# EAGLE design ioboard v1 (EAGLE 6.3)

## Sheet 1 of 2
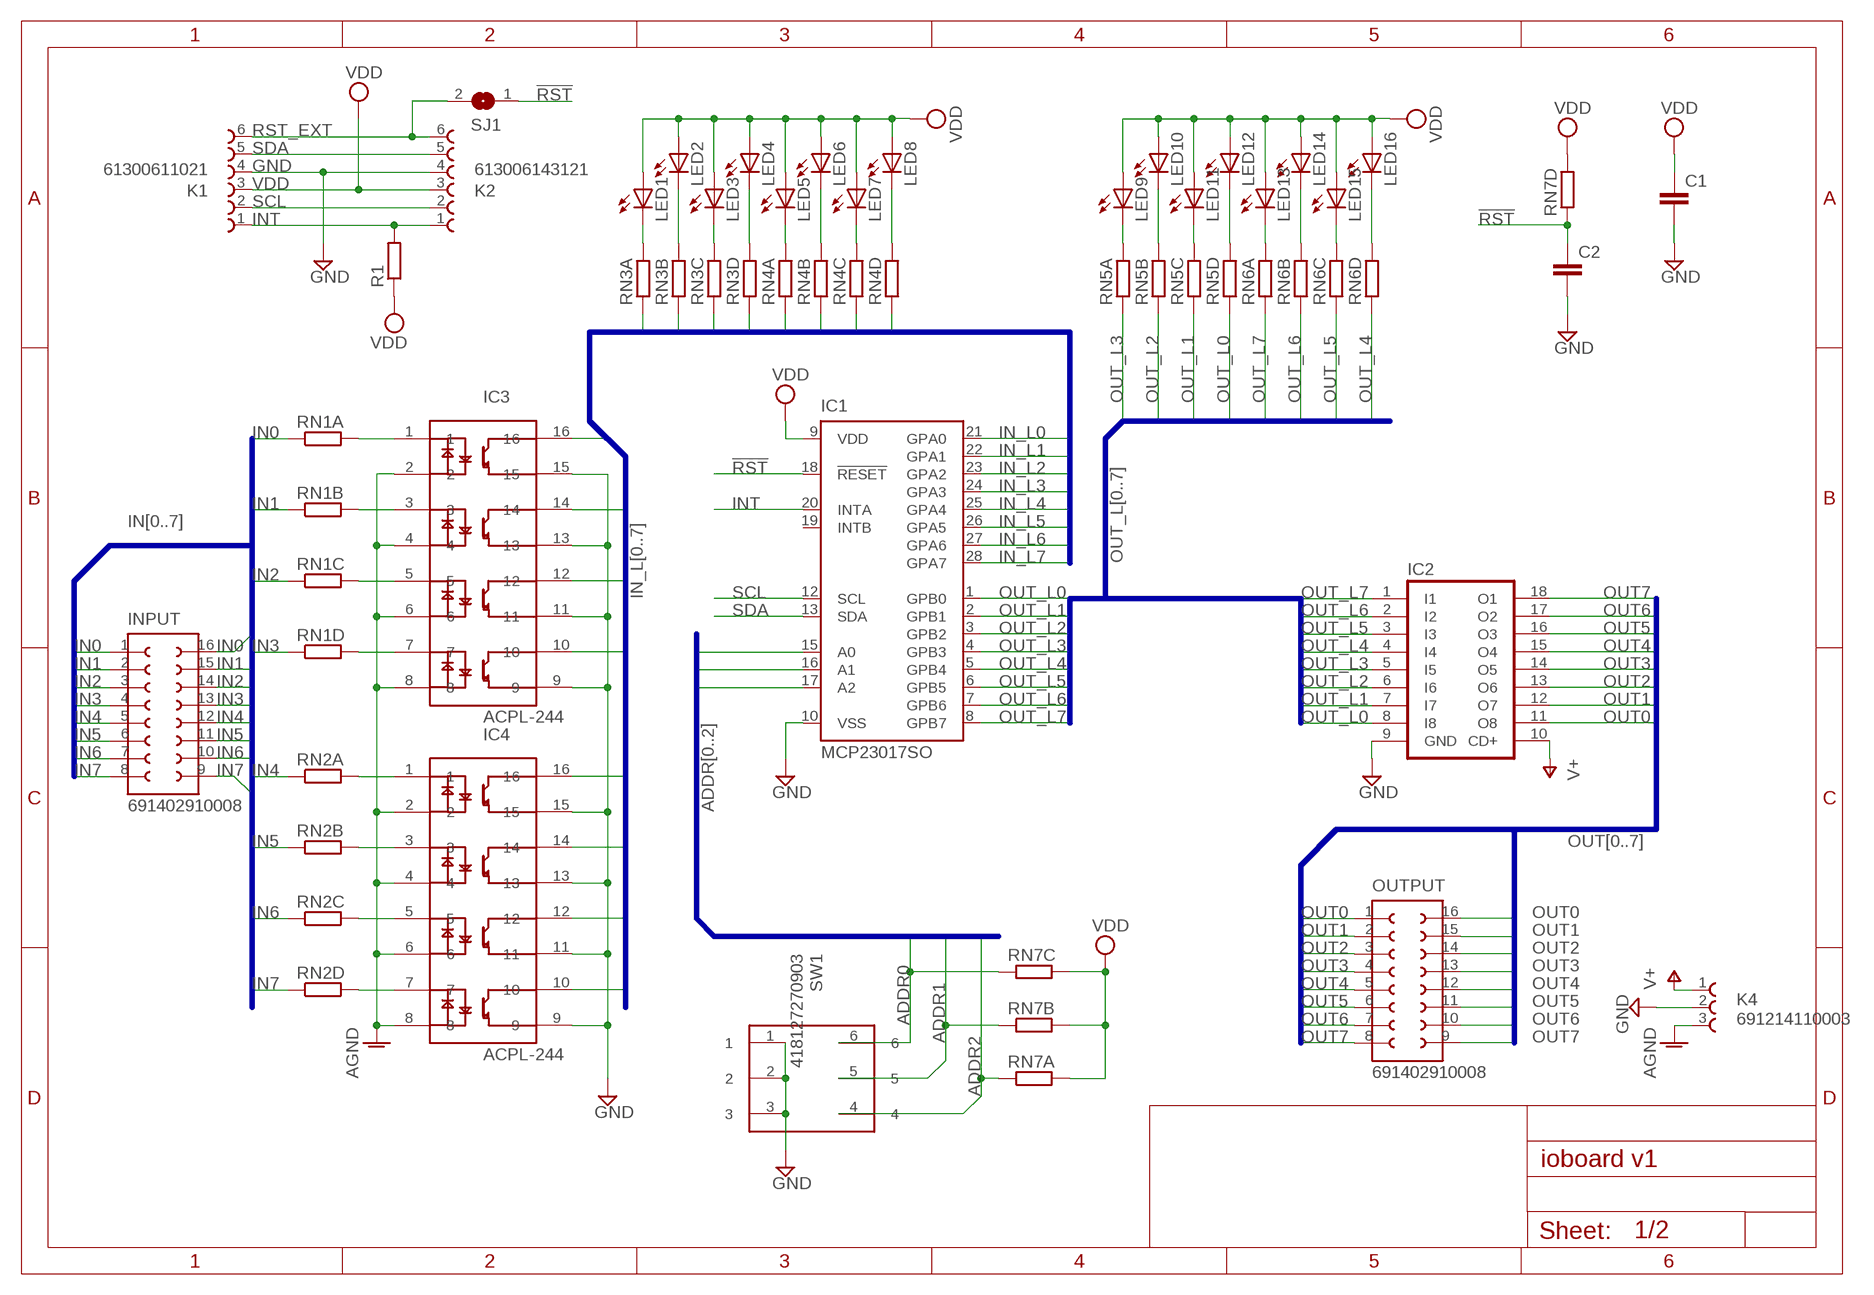
[diagram p0: schematic, sheet 1]

### Parts
C1  C-EUC0805  [C0805]
C2  C-EUC0805  [C0805]
IC1  MCP23017SO  [SO28W]
IC2  ULN2803A  [DIL18]
IC3  ACPL-244  [SO16]
IC4  ACPL-244  [SO16]
INPUT  691402910008  [691402910008]
K1  61300611021  [61300611021]
K2  613006143121  [613006143121]
K4  691214110003  [691214110003]
LED1  LEDCHIPLED_1206  [CHIPLED_1206]
LED2  LEDCHIPLED_1206  [CHIPLED_1206]
LED3  LEDCHIPLED_1206  [CHIPLED_1206]
LED4  LEDCHIPLED_1206  [CHIPLED_1206]
LED5  LEDCHIPLED_1206  [CHIPLED_1206]
LED6  LEDCHIPLED_1206  [CHIPLED_1206]
LED7  LEDCHIPLED_1206  [CHIPLED_1206]
LED8  LEDCHIPLED_1206  [CHIPLED_1206]
LED9  LEDCHIPLED_1206  [CHIPLED_1206]
LED10  LEDCHIPLED_1206  [CHIPLED_1206]
LED11  LEDCHIPLED_1206  [CHIPLED_1206]
LED12  LEDCHIPLED_1206  [CHIPLED_1206]
LED13  LEDCHIPLED_1206  [CHIPLED_1206]
LED14  LEDCHIPLED_1206  [CHIPLED_1206]
LED15  LEDCHIPLED_1206  [CHIPLED_1206]
LED16  LEDCHIPLED_1206  [CHIPLED_1206]
OUTPUT  691402910008  [691402910008]
R1  R-EU_R0805  [R0805]
RN1  RESISTOR_ARRAY_4  [RN8P-4R-CRA06S]
RN2  RESISTOR_ARRAY_4  [RN8P-4R-CRA06S]
RN3  RESISTOR_ARRAY_4  [RN8P-4R-CRA06S]
RN4  RESISTOR_ARRAY_4  [RN8P-4R-CRA06S]
RN5  RESISTOR_ARRAY_4  [RN8P-4R-CRA06S]
RN6  RESISTOR_ARRAY_4  [RN8P-4R-CRA06S]
RN7  RESISTOR_ARRAY_4  [RN8P-4R-CRA06S]
SJ1  SJ  [SJ]
SW1  418127270903  [418127270903]

### Nets
!RST: C2.1 IC1.18(!RESET) RN7.4 SJ1.1
ADDR0: IC1.15(A0) RN7.3 SW1.6
ADDR1: IC1.16(A1) RN7.2 SW1.5
ADDR2: IC1.17(A2) RN7.1 SW1.4
AGND: IC3.2 IC3.4 IC3.6 IC3.8 IC4.2 IC4.4 IC4.6 IC4.8 K4.3
GND [power]: C1.2 C2.2 IC1.10(VSS) IC2.9(GND) IC3.9 IC3.11 IC3.13 IC3.15 IC4.9 IC4.11 IC4.13 IC4.15 K1.4 K2.4 K4.2 SW1.1 SW1.2 SW1.3
IN0: INPUT.1 INPUT.16 RN1.1
IN1: INPUT.2 INPUT.15 RN1.2
IN2: INPUT.3 INPUT.14 RN1.3
IN3: INPUT.4 INPUT.13 RN1.4
IN4: INPUT.5 INPUT.12 RN2.1
IN5: INPUT.6 INPUT.11 RN2.2
IN6: INPUT.7 INPUT.10 RN2.3
IN7: INPUT.8 INPUT.9 RN2.4
IN_L0: IC1.21(GPA0) IC3.16 RN3.1
IN_L1: IC1.22(GPA1) IC3.14 RN3.2
IN_L2: IC1.23(GPA2) IC3.12 RN3.3
IN_L3: IC1.24(GPA3) IC3.10 RN3.4
IN_L4: IC1.25(GPA4) IC4.16 RN4.1
IN_L5: IC1.26(GPA5) IC4.14 RN4.2
IN_L6: IC1.27(GPA6) IC4.12 RN4.3
IN_L7: IC1.28(GPA7) IC4.10 RN4.4
INT: IC1.20(INTA) K1.1 K2.1 R1.2
N$9: IC3.1 RN1.8
N$10: IC3.3 RN1.7
N$11: IC3.5 RN1.6
N$12: IC3.7 RN1.5
N$13: IC4.1 RN2.8
N$14: IC4.3 RN2.7
N$15: IC4.5 RN2.6
N$16: IC4.7 RN2.5
N$17: LED1.C RN3.8
N$18: LED2.C RN3.7
N$25: LED9.C RN5.8
N$26: LED10.C RN5.7
N$27: LED11.C RN5.6
N$28: LED12.C RN5.5
N$29: LED3.C RN3.6
N$30: LED4.C RN3.5
N$31: LED13.C RN6.8
N$32: LED14.C RN6.7
N$33: LED15.C RN6.6
N$34: LED16.C RN6.5
N$36: LED5.C RN4.8
N$37: LED6.C RN4.7
N$38: LED7.C RN4.6
N$39: LED8.C RN4.5
OUT0 [low_impedance]: IC2.11(O8) OUTPUT.1 OUTPUT.16
OUT1 [low_impedance]: IC2.12(O7) OUTPUT.2 OUTPUT.15
OUT2 [low_impedance]: IC2.13(O6) OUTPUT.3 OUTPUT.14
OUT3 [low_impedance]: IC2.14(O5) OUTPUT.4 OUTPUT.13
OUT4 [low_impedance]: IC2.15(O4) OUTPUT.5 OUTPUT.12
OUT5 [low_impedance]: IC2.16(O3) OUTPUT.6 OUTPUT.11
OUT6 [low_impedance]: IC2.17(O2) OUTPUT.7 OUTPUT.10
OUT7 [low_impedance]: IC2.18(O1) OUTPUT.8 OUTPUT.9
OUT_L0: IC1.1(GPB0) IC2.8(I8) RN5.4
OUT_L1: IC1.2(GPB1) IC2.7(I7) RN5.3
OUT_L2: IC1.3(GPB2) IC2.6(I6) RN5.2
OUT_L3: IC1.4(GPB3) IC2.5(I5) RN5.1
OUT_L4: IC1.5(GPB4) IC2.4(I4) RN6.4
OUT_L5: IC1.6(GPB5) IC2.3(I3) RN6.3
OUT_L6: IC1.7(GPB6) IC2.2(I2) RN6.2
OUT_L7: IC1.8(GPB7) IC2.1(I1) RN6.1
RST_EXT: K1.6 K2.6 SJ1.2
SCL: IC1.12(SCL) K1.2 K2.2
SDA: IC1.13(SDA) K1.5 K2.5
V+ [low_impedance]: IC2.10(CD+) K4.1
VDD [power]: C1.1 IC1.9(VDD) K1.3 K2.3 LED1.A LED2.A LED3.A LED4.A LED5.A LED6.A LED7.A LED8.A LED9.A LED10.A LED11.A LED12.A LED13.A LED14.A LED15.A LED16.A R1.1 RN7.5 RN7.6 RN7.7 RN7.8
Unconnected: IC1.19(INTB)

### Buses
OUT[0..7]
IN_L[0..7]
IN[0..7]
OUT_L[0..7]
ADDR[0..2]

## Sheet 2 of 2

## Library data of the parts
C1 C2 = rcl:C-EU: CAPACITOR, European symbol; MF: AVX; MPN: 08051A100JAT2A; OC_FARNELL: 499158
IC1 = adafruit:MCP23017: http://ww1.microchip.com/downloads/en/DeviceDoc/21952a.pdf Source: http://ww1.microchip.com/downloads/en/DeviceDoc/21952a.pdf; MF: MICROCHIP; MPN: MCP23017-E/SO; OC_FARNELL: 1332087
IC2 = ic:ULN2803A: DRIVER ARRAY; MF: TOSHIBA; MPN: ULN2803APG; OC_FARNELL: 1047761
IC3 IC4 = ic:ACPL-244: 4-channel optocoupler by Avago; MF: AVAGO TECHNOLOGIES; MPN: ACPL-244-500E; OC_FARNELL: 1634755
INPUT OUTPUT = Wuerth_Elektronik_eiCan_14_Terminal_Blocks_WR-TBL_2_0:691402910008: WR-TBL Serie 4029 - 2.54mm Screwless Horizontal Entry - 0.5mm2 Wires, 8 Pins; OC_FARNELL: unknown
K1 = Wuerth_Elektronik_eiCan_01_Pin__Socked_Headers_v1_3:61300611021: WR-PHD 2.54mm Angled Pin Header, 6 Pins; OC_FARNELL: unknown
K2 = Wuerth_Elektronik_eiCan_01_Pin__Socked_Headers_v1_3:613006143121: WR-PHD 2.54mm Angled Socket Header, 6 Pins; OC_FARNELL: unknown
K4 = Wuerth_Elektronik_eiCan_14_Terminal_Blocks_WR-TBL_2_0:691214110003: WR-TBL Serie 2141 - 3.5mm Horizontal Entry Modular with Rising Cage Clamp - 1.3 mm2 Wires, 3 Pins; MF: WURTH ELEKTRONIK; MPN: 691214110003; OC_FARNELL: 1841251
LED1-LED16 = led:LED: LED OSRAM: - CHIPLED LG R971, LG N971, LY N971, LG Q971, LY Q971, LO R971, LY R971 LH N974, LH R974 LS Q976, LO Q976, LY Q976 LO Q996 - Hyper CHIPLED LW Q18S LB Q993, LB Q99A, LB R99A - SideLED LS A670, LO A670, LY A670, LG A670, LP A670 LB A673, LV A673, LT A673, LW A673 LH A674 LY A675 LS A676, LA A676, LO A676, LY A676, LW A676 LS A679, LY A679, LG A679 - Hyper Micro SIDELED® LS Y876, LA Y876, LO Y876, LY Y876 LT Y87S - SmartLED LW L88C, LW L88S LB L89C, LB L89S, LG L890 LS L89K, LO L89K, LY L89K LS L896, LA L896, LO L896, LY L896 - TOPLED LS T670, LO T670, LY T670, LG T670, LP T670 LSG T670, LSP T670, LSY T670, LOP T670, LYG T670 LG T671, LOG T671, LSG T671 LB T673, LV T673, LT T673, LW T673 LH T674 LS T676, LA T676, LO T676, LY T676, LB T676, LH T676, LSB T676, LW T676 LB T67C, LV T67C, LT T67C, LS T67K, LO T67K, LY T67K, LW E67C LS E67B, LA E67B, LO E67B, LY E67B, LB E67C, LV E67C, LT E67C LW T67C LS T679, LY T679, LG T679 LS T770, LO T770, LY T770, LG T770, LP T770 LB T773, LV T773, LT T773, LW T773 LH T774 LS E675, LA E675, LY E675, LS T675 LS T776, LA T776, LO T776, LY T776, LB T776 LHGB T686 LT T68C, LB T68C - Hyper Mini TOPLED® LB M676 - Mini TOPLED Santana® LG M470 LS M47K, LO M47K, LY M47K Source: http://www.osram.convergy.de LUXEON: - LUMILED® LXK2-PW12-R00, LXK2-PW12-S00, LXK2-PW14-U00, LXK2-PW14-V00 LXK2-PM12-R00, LXK2-PM12-S00, LXK2-PM14-U00 LXK2-PE12-Q00, LXK2-PE12-R00, LXK2-PE12-S00, LXK2-PE14-T00, LXK2-PE14-U00 LXK2-PB12-K00, LXK2-PB12-L00, LXK2-PB12-M00, LXK2-PB14-N00, LXK2-PB14-P00, LXK2-PB14-Q00 LXK2-PR12-L00, LXK2-PR12-M00, LXK2-PR14-Q00, LXK2-PR14-R00 LXK2-PD12-Q00, LXK2-PD12-R00, LXK2-PD12-S00 LXK2-PH12-R00, LXK2-PH12-S00 LXK2-PL12-P00, LXK2-PL12-Q00, LXK2-PL12-R00 Source: www.luxeon.com KINGBRIGHT: KA-3528ASYC Source: www.kingbright.com; OC_FARNELL: unknown
R1 = rcl:R-EU_: RESISTOR, European symbol; OC_FARNELL: unknown
RN1-RN7 = dp_devices:RESISTOR_ARRAY_4: 4 Resistor Array 0603; OC_FARNELL: unknown
SJ1 = jumper:SJ: SMD solder JUMPER; OC_FARNELL: unknown
SW1 = Eagle_Wuerth_Elektronik_Switch_Power_Elements:418127270903: WS-IC 2.54 mm small compact THT Dip Switch with raised actuator, 3 Pole; OC_FARNELL: unknown

## Net classes
0 default: width 0.4 mm, drill 0.35 mm, clearance 0.2 mm
1 power: width 1 mm, drill 0.35 mm, clearance 0.2 mm
2 low_impedance: width 1.5 mm, drill 0.35 mm, clearance 0.2 mm

## Board
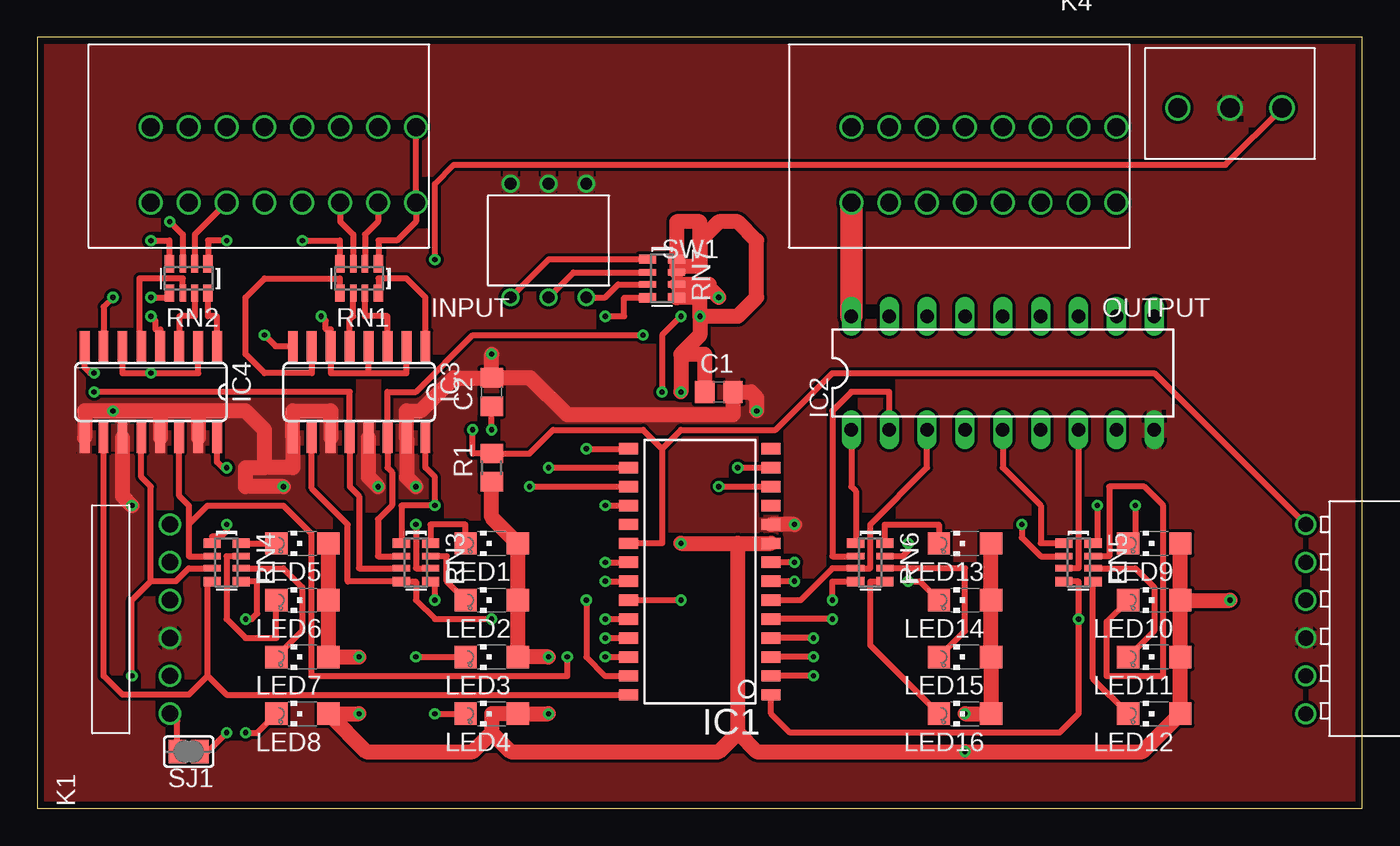
[diagram p1: board, top side]
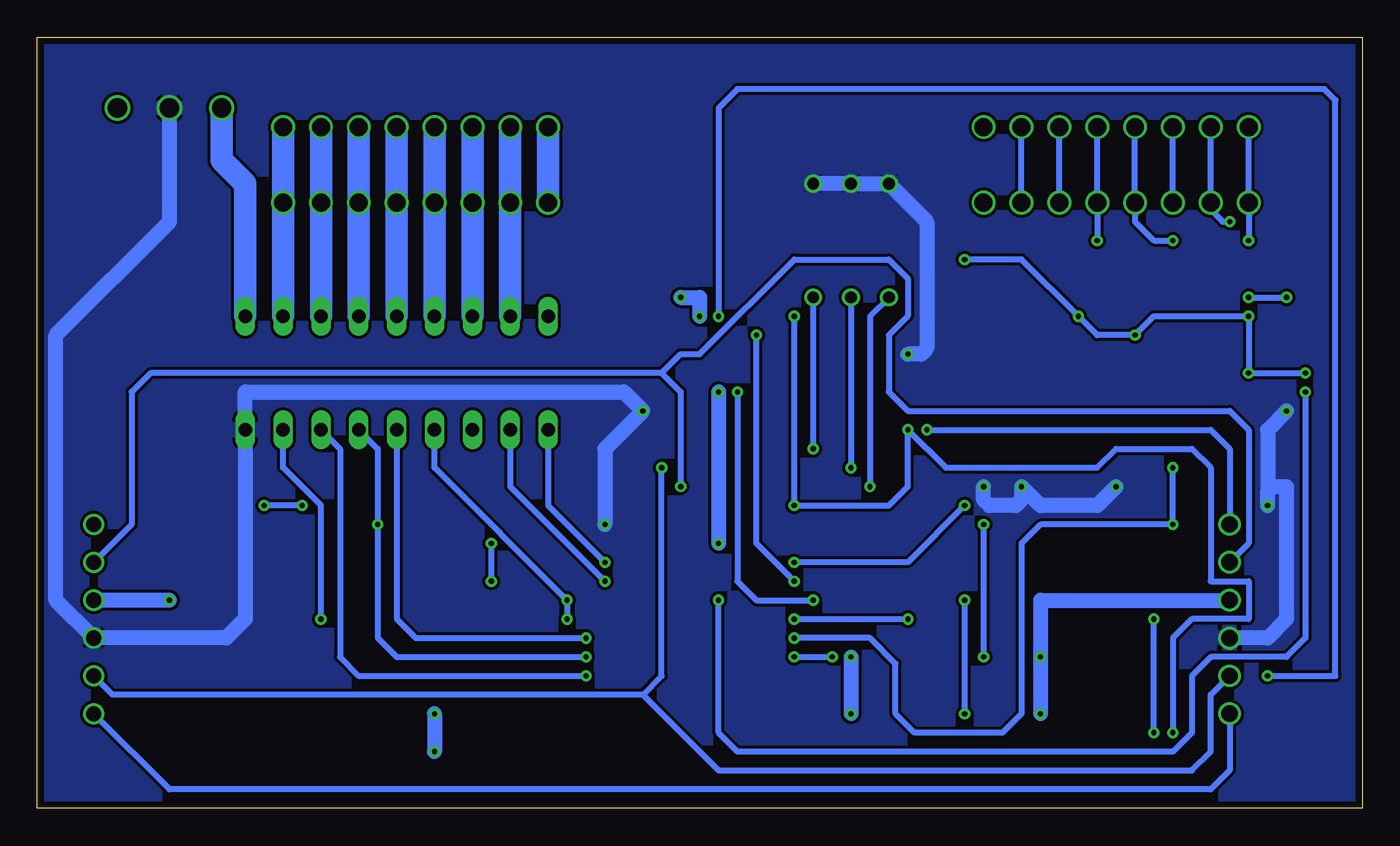
[diagram p2: board, bottom side, seen from below]

Size 88.88 x 51.74 mm. Coordinates in mm from the lower left corner, seen from the top.
Outline: 0,0 88.88,0 88.88,51.74 0,51.74 0,0
Copper layers (1*16): Top 0.018mm / dielectric 1.55mm / Bottom 0.018mm
Design rules "eC-STANDARD_pool-2-layer ": minimum track width 0.2mm, minimum drill 0.25mm, track to track 0.2mm, track to pad 0.2mm, pad to pad 0.2mm, via to via 0.2mm, smd to smd 0.15mm, copper to edge 0.45mm, drill to drill 0.3mm, minimum pad ring 0.2mm, minimum via ring 0.2mm, stop-mask expansion 0.1mm, vias tented up to drill 0mil, thermal gap 0.2mm

### Footprints (pad centres in the part's own frame; a part is rotated, then mirrored left to right if it is on the bottom)
C0805 = smd 1.3 x 1.5: 1 -0.95,0; 2 0.95,0
SO28W = smd 0.762 x 1.27: 1 -7.62,-4.78; 2 -6.35,-4.78; 3 -5.08,-4.78; 4 -3.81,-4.78; 5 -2.54,-4.78; 6 -1.27,-4.78; 7 0,-4.78; 8 1.27,-4.78; 9 2.54,-4.78; 10 3.81,-4.78; 11 5.08,-4.78; 12 6.35,-4.78; 13 7.62,-4.78; 14 8.89,-4.78; 15 8.89,4.78; 16 7.62,4.78; 17 6.35,4.78; 18 5.08,4.78; 19 3.81,4.78; 20 2.54,4.78; 21 1.27,4.78; 22 0,4.78; 23 -1.27,4.78; 24 -2.54,4.78; 25 -3.81,4.78; 26 -5.08,4.78; 27 -6.35,4.78; 28 -7.62,4.78
DIL18 = drill 0.9 long: 1 -10.16,-3.81; 2 -7.62,-3.81; 3 -5.08,-3.81; 4 -2.54,-3.81; 5 0,-3.81; 6 2.54,-3.81; 7 5.08,-3.81; 8 7.62,-3.81; 9 10.16,-3.81; 10 10.16,3.81; 11 7.62,3.81; 12 5.08,3.81; 13 2.54,3.81; 14 0,3.81; 15 -2.54,3.81; 16 -5.08,3.81; 17 -7.62,3.81; 18 -10.16,3.81
SO16 = smd 0.66 x 2.032: 1 -4.445,-3.073; 2 -3.175,-3.073; 3 -1.905,-3.073; 4 -0.635,-3.073; 5 0.635,-3.073; 6 1.905,-3.073; 7 3.175,-3.073; 8 4.445,-3.073; 9 4.445,3.073; 10 3.175,3.073; 11 1.905,3.073; 12 0.635,3.073; 13 -0.635,3.073; 14 -1.905,3.073; 15 -3.175,3.073; 16 -4.445,3.073
691402910008 = drill 1.2: 1 -10.16,0; 2 -7.62,0; 3 -5.08,0; 4 -2.54,0; 5 0,0; 6 2.54,0; 7 5.08,0; 8 7.62,0; 9 7.62,5.08; 10 5.08,5.08; 11 2.54,5.08; 12 0,5.08; 13 -2.54,5.08; 14 -5.08,5.08; 15 -7.62,5.08; 16 -10.16,5.08
61300611021 = drill 1.1: 1 6.35,0; 2 3.81,0; 3 1.27,0; 4 -1.27,0; 5 -3.81,0; 6 -6.35,0
613006143121 = drill 1.02: 1 0,0; 2 2.54,0; 3 5.08,0; 4 7.62,0; 5 10.16,0; 6 12.7,0
691214110003 = drill 1.3: 1 -3.5,0; 2 0,0; 3 3.5,0
CHIPLED_1206 = smd 1.5 x 1.5: A 0,-1.75; C 0,1.75
R0805 = smd 1.3 x 1.5: 1 -0.95,0; 2 0.95,0
RN8P-4R-CRA06S = smd 0.63 x 1.15: 1 -1.295,-0.975; 4 1.295,-0.975; 5 1.295,0.975; 8 -1.295,0.975 | smd 0.44 x 1.15: 2 -0.4,-0.975; 3 0.4,-0.975; 6 0.4,0.975; 7 -0.4,0.975
SJ = smd 1.168 x 1.6: 1 -0.762,0; 2 0.762,0
418127270903 = drill 0.8: 1 0,-3.81; 2 2.54,-3.81; 3 5.08,-3.81; 4 5.08,3.81; 5 2.54,3.81; 6 0,3.81

### Placement (x,y rotation side)
C1  45.72,27.94 0 top
C2  30.48,27.94 90 top
IC1  44.45,15.24 90 top
IC2  64.77,29.21 0 top
IC3  21.59,27.94 180 top
IC4  7.62,27.94 180 top
INPUT  15.24,45.72 180 top
K1  8.89,12.7 90 top
K2  85.09,19.05 270 top
K4  80.01,46.99 0 top
LED1  30.48,17.78 90 top
LED2  30.48,13.97 90 top
LED3  30.48,10.16 90 top
LED4  30.48,6.35 90 top
LED5  17.78,17.78 90 top
LED6  17.78,13.97 90 top
LED7  17.78,10.16 90 top
LED8  17.78,6.35 90 top
LED9  74.93,17.78 90 top
LED10  74.93,13.97 90 top
LED11  74.93,10.16 90 top
LED12  74.93,6.35 90 top
LED13  62.23,17.78 90 top
LED14  62.23,13.97 90 top
LED15  62.23,10.16 90 top
LED16  62.23,6.35 90 top
OUTPUT  62.23,45.72 180 top
R1  30.48,22.86 90 top
RN1  21.59,35.56 180 top
RN2  10.16,35.56 180 top
RN3  25.4,16.51 270 top
RN4  12.7,16.51 270 top
RN5  69.85,16.51 270 top
RN6  55.88,16.51 270 top
RN7  41.91,35.56 270 top
SJ1  10.16,3.81 180 top
SW1  36.83,38.1 180 top

### Tracks (layer width: path | path; a pad name or v marks a point on that pad's centre or on a via)
!RST  (via drill 0.35 pad 0.75)
  Top 0.4: v38.1,33.02 39.37,33.02 39.37,34.27 RN7.4 | v30.48,25.4 C2.1 | v38.1,20.32 IC1.18
  Top 0.406: SJ1.1 11.43,3.81 v12.7,5.08
  Bottom 0.4: v12.7,5.08 12.7,11.43 11.43,12.7 7.62,12.7 7.62,15.24 10.16,15.24 10.16,22.86 11.43,24.13 16.51,24.13 17.78,22.86 27.94,22.86 v30.48,25.4 30.48,21.59 31.75,20.32 v38.1,20.32 v38.1,33.02
ADDR0  (via drill 0.35 pad 0.75)
  Top 0.4: SW1.6 38.1,34.29 38.97,35.16 RN7.3 | v36.83,24.13 IC1.15
  Bottom 0.4: SW1.6 v36.83,24.13
ADDR1  (via drill 0.35 pad 0.75)
  Top 0.4: SW1.5 35.96,35.96 RN7.2 | v34.29,22.86 IC1.16
  Bottom 0.4: SW1.5 v34.29,22.86
ADDR2  (via drill 0.35 pad 0.75)
  Top 0.4: SW1.4 34.31,36.85 RN7.1 | v33.02,21.59 IC1.17
  Bottom 0.4: SW1.4 33.02,33.02 v33.02,21.59
AGND  (via drill 0.35 pad 0.75)
  Top 0.4: IC3.2 24.77,29.21 22.23,29.21 | 22.23,29.21 19.68,29.21 IC3.6 19.68,32.14 19.34,32.14 19.34,32.73 v19.05,33.02 | IC4.2 10.79,29.21 v7.62,29.21 5.71,29.21 IC4.6 | 22.23,29.21 IC3.4 | v3.81,29.21 3.55,29.21 3.17,29.59 IC4.8 | v26.67,36.83 26.67,41.91 27.94,43.18 79.7,43.18 K4.3 | v7.62,33.02 7.92,32.73 7.92,32.14 8.26,32.14 IC4.4 | v15.24,31.75 15.98,31.01 IC3.8
  Bottom 0.4: v3.81,29.21 v7.62,29.21 v7.62,33.02 13.97,33.02 v15.24,31.75 17.78,31.75 v19.05,33.02 22.86,36.83 v26.67,36.83
GND  (via drill 0.35 pad 0.75)
  Top 1: 15.24,22.86 15.24,25.4 13.97,26.67 10.79,26.67 | 10.79,26.67 8.26,26.67 | 10.79,26.67 IC4.15 | C2.2 27.94,28.89 25.72,26.67 24.77,26.67 IC3.15 24.77,22.23 v25.4,21.59 | C2.2 33.06,28.89 35.56,26.39 46.67,26.39 C1.2 47.88,27.94 48.26,27.57 v48.26,26.67 | 15.24,22.86 17.14,22.86 IC3.9 17.14,26.67 19.68,26.67 IC3.11 | v16.51,21.59 13.97,21.59 13.97,22.86 15.24,22.86 | 8.26,26.67 v5.08,26.67 3.17,26.67 IC4.9 | 8.26,26.67 IC4.13 | C2.2 v30.48,30.48 | v50.8,19.05 IC1.10 | v22.86,21.59 22.23,22.23 IC3.13 | v6.35,20.32 5.71,20.95 IC4.11
  Bottom 1: 6.35,21.21 5.97,21.59 5.08,21.59 5.08,12.7 6.35,11.43 K1.4 | v5.08,26.67 6.35,25.4 6.35,21.21 | K4.2 80.01,39.37 87.63,31.75 87.63,13.97 K2.4 76.2,11.43 74.93,12.7 IC2.9 74.93,27.94 49.53,27.94 v48.26,26.67 50.8,24.13 v50.8,19.05 | v6.35,20.32 6.35,21.21 | v16.51,21.59 17.78,20.32 21.59,20.32 v22.86,21.59 22.86,20.7 23.23,20.32 25.02,20.32 25.4,20.7 v25.4,21.59 | SW1.1 SW1.2 SW1.3 29.21,39.37 29.21,30.86 29.59,30.48 v30.48,30.48
  pour Top (isolate 0.2): 0,0 0,52.07 88.9,52.07 88.9,0
  pour Bottom (isolate 0.2): 0,0 0,52.07 88.9,52.07 88.9,0
IN0
  Top 0.4: RN1.1 22.89,38.1 24.13,38.1 25.4,39.37 INPUT.16 INPUT.1
IN1
  Top 0.4: INPUT.15 22.86,39.37 21.99,38.5 RN1.2
  Bottom 0.4: INPUT.15 INPUT.2
IN2
  Top 0.4: INPUT.14 20.32,39.37 21.19,38.5 RN1.3
  Bottom 0.4: INPUT.14 INPUT.3
IN3  (via drill 0.35 pad 0.75)
  Top 0.4: v17.78,38.1 20.3,38.1 RN1.4
  Bottom 0.4: INPUT.4 INPUT.13 v17.78,38.1
IN4  (via drill 0.35 pad 0.75)
  Top 0.4: v12.7,38.1 11.46,38.1 RN2.1
  Bottom 0.4: v12.7,38.1 13.97,38.1 15.24,39.37 INPUT.12 INPUT.5
IN5
  Top 0.4: INPUT.11 10.56,38.5 RN2.2
  Bottom 0.4: INPUT.11 INPUT.6
IN6  (via drill 0.35 pad 0.75)
  Top 0.4: v8.89,39.37 9.76,38.5 RN2.3
  Bottom 0.4: v8.89,39.37 9.36,39.37 10.16,40.17 INPUT.10 INPUT.7
IN7  (via drill 0.35 pad 0.75)
  Top 0.4: v7.62,38.1 8.87,38.1 RN2.4
  Bottom 0.4: INPUT.8 INPUT.9 v7.62,38.1
IN_L0  (via drill 0.35 pad 0.75)
  Top 0.4: RN3.1 24.43,20.32 v26.67,20.32 26.67,22.23 26.04,22.86 IC3.16 | v38.1,16.51 IC1.21
  Bottom 0.4: v26.67,20.32 30.48,16.51 v38.1,16.51
IN_L1  (via drill 0.35 pad 0.75)
  Top 0.4: RN3.2 22.86,16.91 22.86,19.39 23.79,20.32 23.79,22.56 23.5,22.86 IC3.14 23.5,27.94 25.4,27.94 29.21,31.75 v40.64,31.75 | v38.1,15.24 IC1.22
  Bottom 0.4: v38.1,15.24 40.64,17.78 v40.64,31.75
IN_L2  (via drill 0.35 pad 0.75)
  Top 0.4: RN3.3 21.59,16.11 21.59,20.95 20.95,21.59 IC3.12 20.95,27.94 v3.81,27.94 | v43.18,13.97 IC1.23
  Bottom 0.4: v3.81,27.94 3.81,11.43 5.08,10.16 10.16,10.16 11.43,8.89 11.43,5.08 12.7,3.81 41.91,3.81 43.18,5.08 v43.18,13.97
IN_L3  (via drill 0.35 pad 0.75)
  Top 0.4: IC3.10 18.41,21.47 20.84,19.05 20.84,15.21 RN3.4 25.4,15.21 25.4,13.97 26.67,12.7 v30.48,12.7 | v38.1,12.7 IC1.24
  Bottom 0.4: v38.1,12.7 v30.48,12.7
IN_L4  (via drill 0.35 pad 0.75)
  Top 0.4: v12.7,22.86 12.44,22.86 12.06,23.23 IC4.16 | v38.1,11.43 IC1.25 | v12.7,19.05 12.7,18.61 12.32,18.24 11.72,18.24 RN4.1
  Bottom 0.4: v12.7,22.86 v12.7,19.05 21.59,19.05 22.86,17.78 22.86,6.35 24.13,5.08 30.03,5.08 31.3,6.35 31.3,9.71 33.02,11.43 v38.1,11.43
IN_L5  (via drill 0.35 pad 0.75)
  Top 0.4: 10.16,19.05 10.16,20.32 9.53,20.95 IC4.14 | 10.16,19.05 10.16,16.91 RN4.2 | 10.16,19.05 11.43,20.32 16.51,20.32 18.38,18.45 18.38,8.89 35.56,8.89 v35.56,10.16 | v38.1,10.16 IC1.26
  Bottom 0.4: v38.1,10.16 v35.56,10.16
IN_L6  (via drill 0.35 pad 0.75)
  Top 0.4: 7.62,15.24 7.62,21.59 6.99,22.23 IC4.12 | v6.35,8.89 6.35,13.97 7.62,15.24 | 7.62,15.24 9.29,15.24 10.16,16.11 RN4.3 | v36.83,13.97 36.83,10.16 38.1,8.89 IC1.27 | v43.18,33.02 41.91,31.75 v41.91,27.94
  Bottom 0.4: v41.91,27.94 41.91,15.24 40.64,13.97 v36.83,13.97 | v6.35,8.89 1.8,8.89 1.8,47.52 2.54,48.26 41.91,48.26 43.18,46.99 v43.18,33.02
IN_L7
  Top 0.4: 11.43,8.89 10.16,7.62 5.71,7.62 4.45,8.89 IC4.10 | 11.43,8.89 11.43,15.21 RN4.4 | 11.43,8.89 12.7,7.62 IC1.28
INT  (via drill 0.35 pad 0.75)
  Top 0.4: 41.91,24.13 40.64,25.4 34.61,25.4 33.02,23.81 R1.2 29.21,23.81 v29.21,25.4 | 41.91,24.13 41.91,17.78 IC1.20 | 41.91,24.13 43.18,25.4 49.53,25.4 53.34,29.21 74.93,29.21 K2.1
  Bottom 0.4: v29.21,25.4 10.16,25.4 8.89,24.13 K1.1
N$9
  Top 0.4: IC3.1 26.04,34.29 24.77,35.56 22.89,35.56 RN1.8
N$10
  Top 0.4: IC3.3 23.5,33.02 21.99,33.02 RN1.7
N$11
  Top 0.4: IC3.5 20.95,32.78 21.19,33.02 RN1.6
N$12
  Top 0.4: IC3.7 18.41,29.21 15.24,29.21 13.97,30.48 13.97,34.29 15.24,35.56 20.3,35.56 RN1.5
N$13
  Top 0.4: IC4.1 12.06,33.02 11.46,33.02 RN2.8
N$14
  Top 0.4: RN2.7 10.56,33.02 9.53,33.02 IC4.3
N$15
  Top 0.4: RN2.6 9.76,35.56 6.84,35.56 6.84,31.01 IC4.5
N$16  (via drill 0.35 pad 0.75)
  Top 0.4: v5.08,34.29 4.45,33.66 IC4.7 | v7.62,34.29 8.87,34.29 RN2.5
  Bottom 0.4: v7.62,34.29 v5.08,34.29
N$17
  Top 0.4: LED1.C 28.73,19.05 26.38,19.05 RN3.8
N$18
  Top 0.4: LED2.C 27.46,15.23 27.46,16.91 RN3.7
N$25  (via drill 0.35 pad 0.75)
  Top 0.4: v73.66,20.32 73.66,18.26 LED9.C | v71.12,20.32 71.12,17.8 RN5.8
  Bottom 0.4: v71.12,20.32 v73.66,20.32
N$26
  Top 0.4: LED10.C 71.73,12.52 71.73,8.89 75.53,8.89 75.53,20.32 74.26,21.59 71.92,21.59 71.92,16.91 RN5.7
N$27
  Top 0.4: RN5.6 73.66,16.11 74.93,14.84 74.93,11.91 LED11.C
N$28
  Top 0.4: LED12.C 70.83,8.71 RN5.5
N$29  (via drill 0.35 pad 0.75)
  Top 0.4: v25.4,10.16 LED3.C | v25.4,19.05 25.4,16.11 RN3.6
  Bottom 0.4: v25.4,19.05 v25.4,10.16
N$30  (via drill 0.35 pad 0.75)
  Top 0.4: v26.67,6.35 LED4.C | v26.67,13.97 26.67,15.21 RN3.5
  Bottom 0.4: v26.67,13.97 v26.67,6.35
N$31
  Top 0.4: RN6.8 56.85,19.05 60.48,19.05 LED13.C
N$32  (via drill 0.35 pad 0.75)
  Top 0.4: v58.42,17.78 58.42,17.29 58.05,16.91 RN6.7 | v58.42,15.24 59.21,15.24 LED14.C
  Bottom 0.4: v58.42,15.24 v58.42,17.78
N$33
  Top 0.4: LED15.C 62.23,11.91 62.23,16.11 RN6.6
N$34
  Top 0.4: LED16.C 55.88,10.95 55.88,15.21 RN6.5
N$36
  Top 0.4: RN4.8 13.97,17.8 13.99,17.78 LED5.C
N$37
  Top 0.4: RN4.7 12.7,16.91 12.7,12.7 13.97,11.43 16.03,11.43 LED6.C
N$38
  Top 0.4: RN4.6 16.51,16.11 17.78,14.84 17.78,11.91 LED7.C
N$39  (via drill 0.35 pad 0.75)
  Top 0.4: v13.97,12.7 14.39,12.7 14.77,13.07 14.77,15.21 RN4.5 | v13.97,5.08 14.76,5.08 LED8.C
  Bottom 0.4: v13.97,5.08 v13.97,12.7
OUT0
  Bottom 1.5: IC2.11 OUTPUT.16 OUTPUT.1
OUT1
  Bottom 1.5: IC2.12 OUTPUT.15 OUTPUT.2
OUT2
  Bottom 1.5: IC2.13 OUTPUT.14 OUTPUT.3
OUT3
  Bottom 1.5: IC2.14 OUTPUT.13 OUTPUT.4
OUT4
  Bottom 1.5: IC2.15 OUTPUT.12 OUTPUT.5
OUT5
  Bottom 1.5: IC2.16 OUTPUT.11 OUTPUT.6
OUT6
  Bottom 1.5: IC2.17 OUTPUT.10 OUTPUT.7
OUT7
  Top 1.5: OUTPUT.9 IC2.18
  Bottom 1.5: OUTPUT.9 OUTPUT.8
OUT_L0  (via drill 0.35 pad 0.75)
  Top 0.4: IC1.1 49.23,6.35 50.5,5.08 68.58,5.08 69.85,6.35 v69.85,12.7 69.85,15.21 RN5.4
  Bottom 0.4: v69.85,12.7 69.85,20.32 72.39,22.86 IC2.8
OUT_L1  (via drill 0.35 pad 0.75)
  Top 0.4: IC2.7 69.85,16.11 RN5.3 | v52.07,8.89 IC1.2
  Bottom 0.4: IC2.7 68.58,24.13 68.58,10.16 67.31,8.89 v52.07,8.89
OUT_L2  (via drill 0.35 pad 0.75)
  Top 0.4: v52.07,10.16 IC1.3 | v66.04,19.05 66.04,18.18 67.31,16.91 RN5.2
  Bottom 0.4: IC2.6 66.04,24.13 v66.04,19.05 66.04,11.43 64.77,10.16 v52.07,10.16
OUT_L3  (via drill 0.35 pad 0.75)
  Top 0.4: IC2.5 64.77,22.86 67.31,20.32 67.31,17.8 RN5.1 | v52.07,11.43 IC1.4
  Bottom 0.4: IC2.5 64.77,12.7 63.5,11.43 v52.07,11.43
OUT_L4  (via drill 0.35 pad 0.75)
  Top 0.4: v53.34,12.7 IC1.5 | v53.34,13.97 53.34,15.21 RN6.4
  Bottom 0.4: IC2.4 62.23,22.86 v53.34,13.97 v53.34,12.7
OUT_L5
  Top 0.4: IC2.3 59.69,22.86 55.88,19.05 55.88,16.11 RN6.3 53.34,16.11 51.2,13.97 IC1.6
OUT_L6  (via drill 0.35 pad 0.75)
  Top 0.4: IC2.2 57.15,27.94 54.61,27.94 53.34,26.67 53.34,16.91 RN6.2 | v50.8,15.24 IC1.7
  Bottom 0.4: IC2.2 57.15,21.59 v50.8,15.24
OUT_L7  (via drill 0.35 pad 0.75)
  Top 0.4: IC2.1 54.61,21.59 54.91,21.3 RN6.1 | v50.8,16.51 IC1.8
  Bottom 0.4: IC2.1 54.61,20.32 v50.8,16.51
RST_EXT
  Top 0.406: SJ1.2 9.4,5.84 K1.6
  Bottom 0.4: K1.6 8.89,2.54 10.16,1.27 80.01,1.27 K2.6
SCL  (via drill 0.35 pad 0.75)
  Top 0.4: v45.72,21.59 IC1.12
  Bottom 0.4: 46.99,29.21 81.28,29.21 82.55,27.94 82.55,19.05 K2.2 | 46.99,29.21 45.72,30.48 44.45,30.48 38.1,36.83 31.75,36.83 30.48,35.56 30.48,33.02 31.75,31.75 31.75,27.94 30.48,26.67 8.89,26.67 7.62,25.4 7.62,17.78 K1.2 | 46.99,29.21 45.72,27.94 v45.72,21.59
SDA  (via drill 0.35 pad 0.75)
  Top 0.4: v46.99,22.86 IC1.13
  Bottom 0.4: 48.26,7.62 43.18,2.54 11.43,2.54 10.16,3.81 10.16,7.62 K1.5 | 48.26,7.62 83.82,7.62 K2.5 | 48.26,7.62 46.99,8.89 v46.99,22.86
V+
  Bottom 1.5: K4.1 76.51,43.49 74.93,41.91 IC2.10
VDD  (via drill 0.35 pad 0.75)
  Top 1: v34.29,10.16 LED3.A LED2.A LED1.A 30.48,19.53 R1.1 | 46.99,5.08 46.99,17.78 | v43.18,17.78 46.99,17.78 | v62.23,6.35 LED16.A LED15.A LED14.A LED13.A | 30.48,5.08 29.21,3.81 22.07,3.81 LED8.A v21.59,6.35 | 30.48,5.08 30.48,6.35 LED4.A v34.29,6.35 | 44.45,38.1 44.45,39.37 42.88,39.37 RN7.8 | 43.18,30.48 44.77,30.48 C1.1 | 46.99,17.78 IC1.9 | v44.45,33.02 46.99,33.02 48.26,34.29 48.26,38.1 46.99,39.37 45.72,39.37 44.45,38.1 | 30.48,5.08 31.75,3.81 45.72,3.81 46.99,5.08 | LED10.A LED11.A LED12.A 74.14,3.81 v62.23,3.81 48.26,3.81 46.99,5.08 | LED10.A LED9.A | LED5.A LED6.A LED7.A v21.59,10.16 | LED10.A v80.01,13.97 | v44.45,33.02 44.45,31.75 43.18,30.48 | 44.45,38.1 44.45,36.36 42.88,36.36 RN7.7 | 43.18,30.48 v43.18,27.94 | v44.45,33.02 44.45,34.27 RN7.5 | v45.72,34.29 45.09,34.92 45.09,35.16 RN7.6
  Bottom 1: K1.3 21.59,13.97 v21.59,10.16 v21.59,6.35 | v80.01,13.97 K2.3 | v34.29,10.16 v34.29,6.35 | v62.23,6.35 v62.23,3.81 | v43.18,27.94 v43.18,17.78 | v44.45,33.02 44.45,34.29 v45.72,34.29